# Altium project Charger.PrjPcb
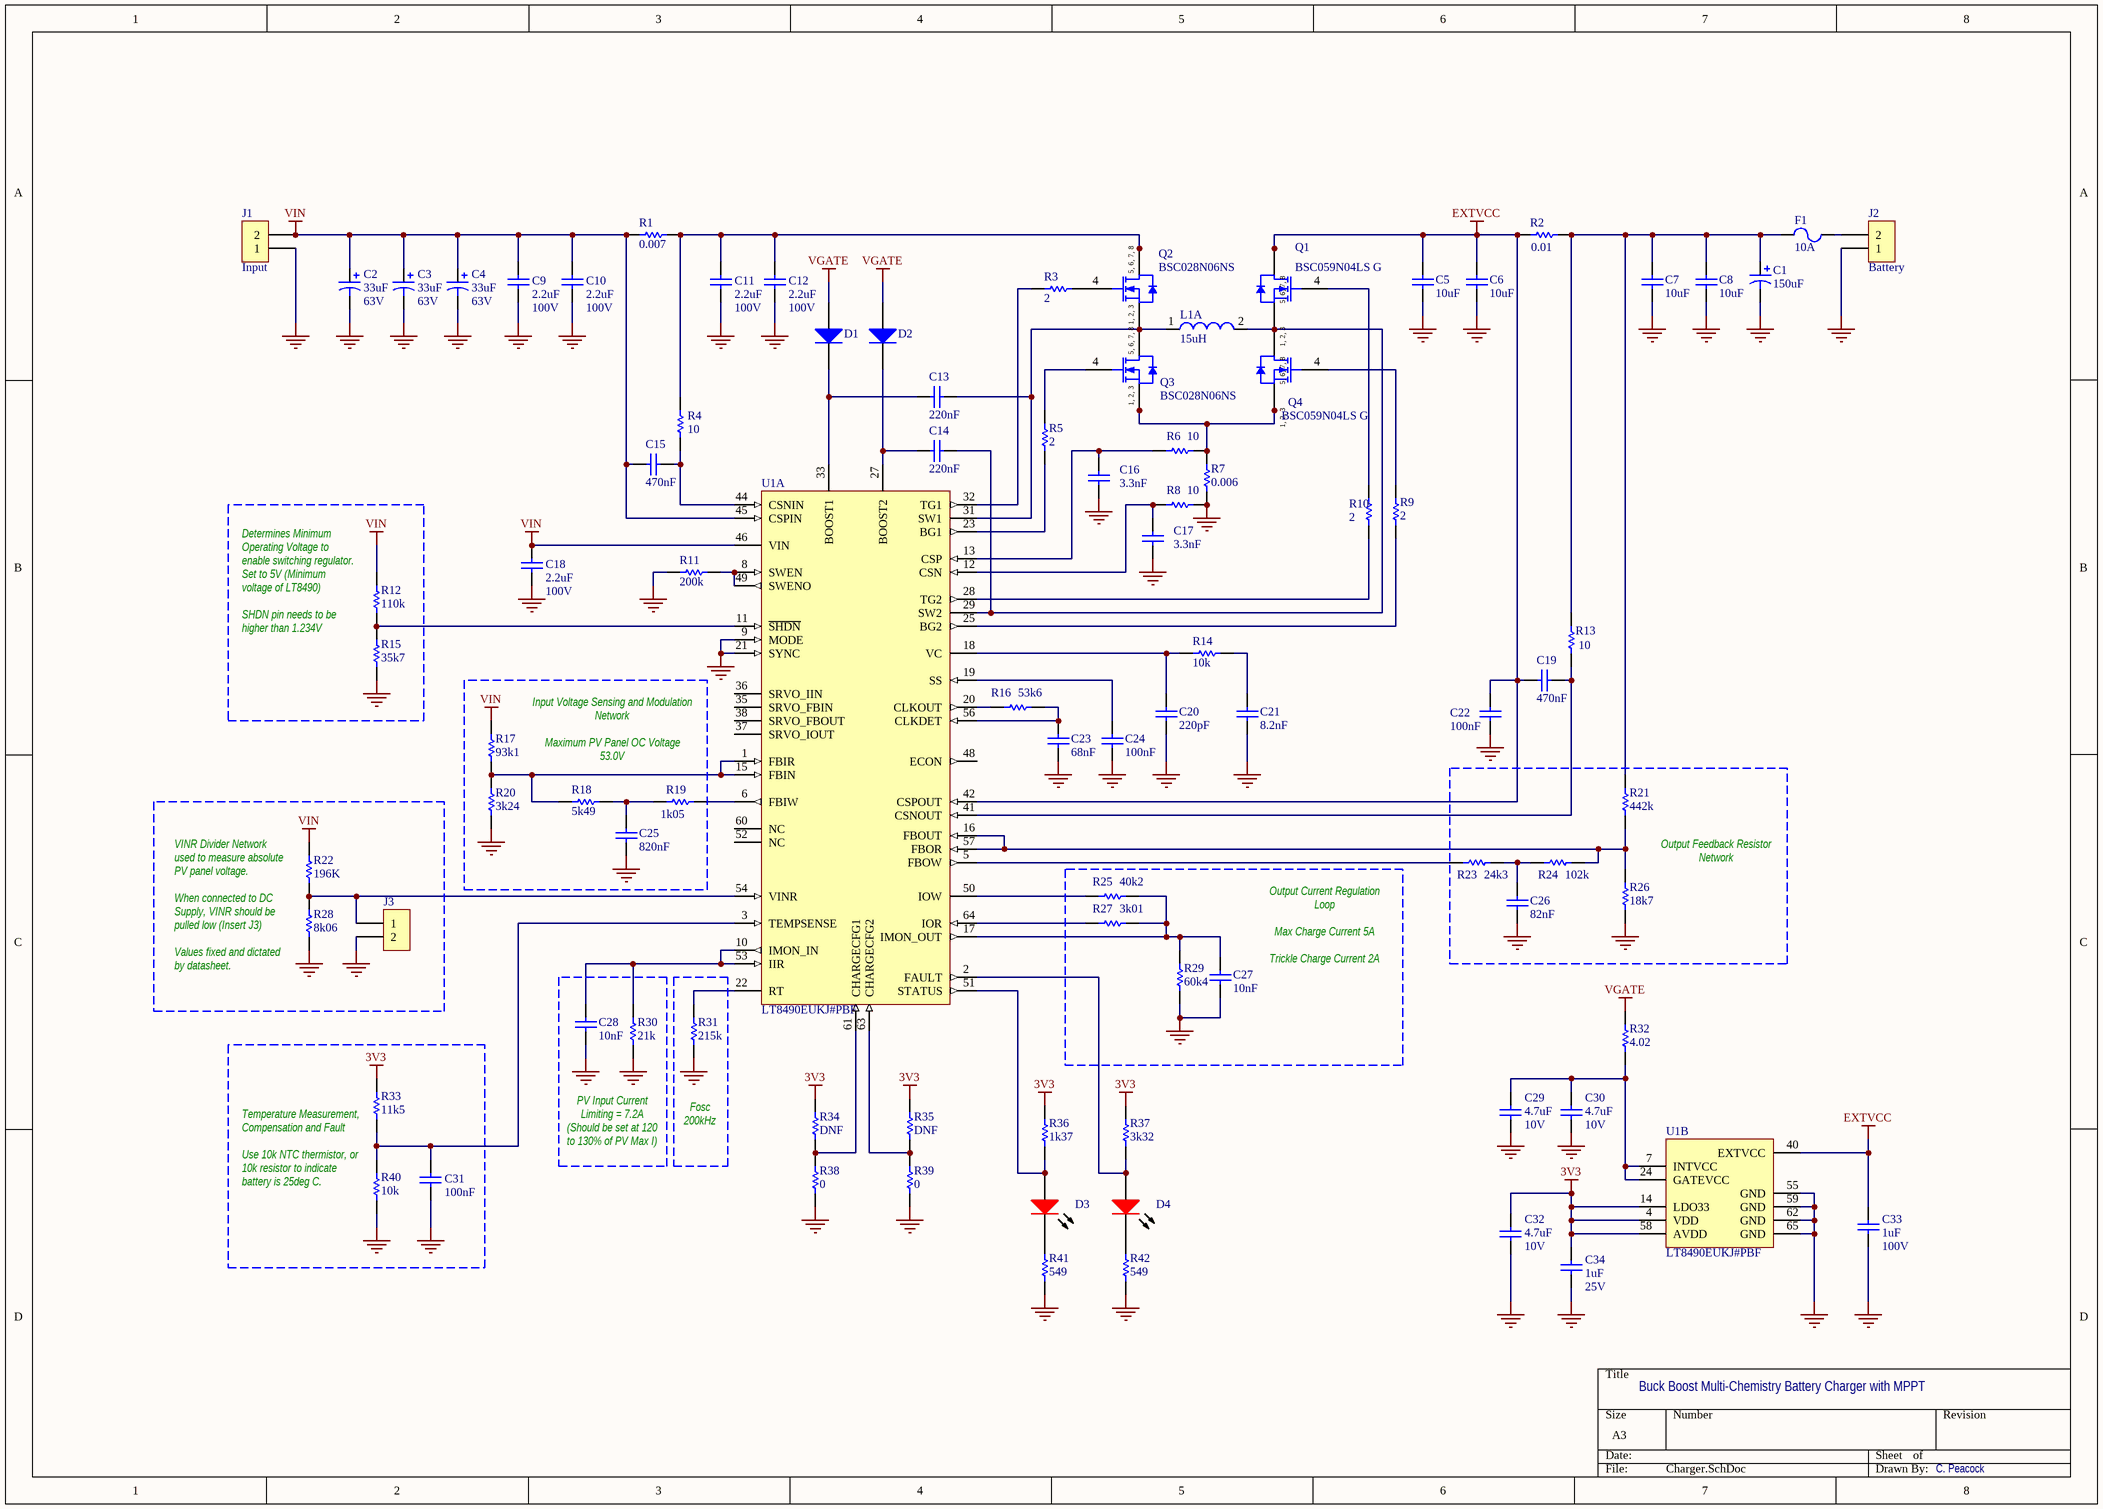
[diagram p0: Charger.SchDoc]
1 sheet, 90 parts. Net scope: global (net labels, ports and power ports of the same name join across sheets).
Board file: Charger.PcbDoc

## Sheet Charger.SchDoc
size A3; PageSetup: Record=PageOptions|CenterHorizontal=True|CenterVertical=True|PrintScale=0.73|XCorrection=1.00|YCorrection=1.00|PrintKind=0|BorderSize=5000000|LeftOffset=0|BottomOffset=0|Orientation=2|PaperLength=1000|PaperWidth=1000|Scale=100|PaperSource=7|PrintQuality=-3|MediaType=1|DitherType=10|PrintScaleMode=1|PaperKind=A4|PaperIndex=9

### Parts
C1  150uF  [PCB-h7n8m0mive84y4pjomrj-1]
C2  33uF  Voltage Rating (DC): 63V  [PCB-9g04u1co75526zy4kkrl-1]
C3  33uF  Voltage Rating (DC): 63V  [PCB-9g04u1co75526zy4kkrl-1]
C4  33uF  Voltage Rating (DC): 63V  [PCB-9g04u1co75526zy4kkrl-1]
C5  10uF  [PCB-41pvis4jpu9wge287x0a-1]
C6  10uF  [PCB-41pvis4jpu9wge287x0a-1]
C7  10uF  [PCB-41pvis4jpu9wge287x0a-1]
C8  10uF  [PCB-41pvis4jpu9wge287x0a-1]
C9  2.2uF  Voltage Rating (DC): 100V  [CAPC3225X279X50NL20T25]
C10  2.2uF  Voltage Rating (DC): 100V  [CAPC3225X279X50NL20T25]
C11  2.2uF  Voltage Rating (DC): 100V  [CAPC3225X279X50NL20T25]
C12  2.2uF  Voltage Rating (DC): 100V  [CAPC3225X279X50NL20T25]
C13  220nF  [CAPC2013X140X50ML20T25]
C14  220nF  [CAPC2013X140X50ML20T25]
C15  470nF  [CAPC2013X140X50ML20T25]
C16  3.3nF  [CAPC2013X94X50ML20T25]
C17  3.3nF  [CAPC2013X94X50ML20T25]
C18  2.2uF  Voltage Rating (DC): 100V  [CAPC3225X279X50NL20T25]
C19  470nF  [CAPC2013X140X50ML20T25]
C20  220pF  [CAPC2013X94X50ML20T25]
C21  8.2nF  [CAPC2013X94X50ML20T25]
C22  100nF  [CAPC2013X140X50ML20T25]
C23  68nF  [CAPC2013X94X50ML20T25]
C24  100nF  [CAPC2013X140X50ML20T25]
C25  820nF  [CAPC2013X95X45NL10T25]
C26  82nF  [CAPC2013X94X50ML20T25]
C27  10nF  [CAPC2013X94X50ML20T25]
C28  10nF  [CAPC2013X94X50ML20T25]
C29  4.7uF  Voltage Rating (DC): 10V  [CAPC2013X140X50ML20T25]
C30  4.7uF  Voltage Rating (DC): 10V  [CAPC2013X140X50ML20T25]
C31  100nF  [CAPC2013X140X50ML20T25]
C32  4.7uF  Voltage Rating (DC): 10V  [CAPC2013X140X50ML20T25]
C33  1uF  Voltage Rating (DC): 100V  [CAPC3225X279X50ML20T25]
C34  1uF  Voltage Rating (DC): 25V  [CAPC2013X140X50ML20T25]
D1  1N4148WS  [FSC-1N4148WS-SOD-323-2]  (value not drawn)
D2  1N4148WS  [FSC-1N4148WS-SOD-323-2]  (value not drawn)
D3  Lite-On LTST-C170KRKT  [PCB-5ta9mte2am12bu12jwvi-1]  (value not drawn)
D4  Lite-On LTST-C170KRKT  [PCB-5ta9mte2am12bu12jwvi-1]  (value not drawn)
F1  10A  [PCB-nlucop3bvobg45y57dd7-1]
J1  Input  [PCB-aknpg75yzj2hq04tmkjt-1]
J2  Battery  [PCB-aknpg75yzj2hq04tmkjt-1]
J3  Molex 90120-0762  [PCB-zbro1p3mqdrs1lkjydms-1]  (value not drawn)
L1  15uH  [WE-HCF 2818]  (part A of 2)
Q1  BSC059N04LS G  [INF-PG-TDSON-8-1_V]
Q2  BSC028N06NS  [INF-PG-TDSON-8-1_V]
Q3  BSC028N06NS  [INF-PG-TDSON-8-1_V]
Q4  BSC059N04LS G  [INF-PG-TDSON-8-1_V]
R1  0.007  [Resistor]
R2  0.01  [Resistor]
R3  2  [RESC2013X60X35NL10T20]
R4  10  [RESC2013X60X35ML10T20]
R5  2  [RESC2013X60X35ML10T20]
R6  10  [RESC2013X60X35ML10T20]
R7  0.006  [Resistor]
R8  10  [RESC2013X60X35ML10T20]
R9  2  [RESC2013X60X35ML10T20]
R10  2  [RESC2013X60X35ML10T20]
R11  200k  [RESC2013X60X35ML10T20]
R12  110k  [RESC2013X60X35ML10T20]
R13  10  [RESC2013X60X35ML10T20]
R14  10k  [RESC2013X60X35ML10T20]
R15  35k7  [RESC2013X60X35ML10T20]
R16  53k6  [RESC2013X60X35ML10T20]
R17  93k1  [RESC2013X60X35ML10T20]
R18  5k49  [RESC2013X60X35ML10T20]
R19  1k05  [RESC2013X60X35ML10T20]
R20  3k24  [RESC2013X60X35ML10T20]
R21  442k  [RESC2013X60X35ML10T20]
R22  196K  [RESC2013X60X35ML10T20]
R23  24k3  [RESC2013X60X35ML10T20]
R24  102k  [RESC2013X60X35ML10T20]
R25  40k2  [RESC2013X60X35ML10T20]
R26  18k7  [RESC2013X60X35ML10T20]
R27  3k01  [RESC2013X60X35ML10T20]
R28  8k06  [RESC2013X60X35ML10T20]
R29  60k4  [RESC2013X60X35ML10T20]
R30  21k  [RESC2013X60X35ML10T20]
R31  215k  [RESC2013X60X35ML10T20]
R32  4.02  [RESC2013X60X35ML10T20]
R33  11k5  [RESC2013X60X35ML10T20]
R34  DNF  [RESC2013X60X35ML10T20]
R35  DNF  [RESC2013X60X35ML10T20]
R36  1k37  [RESC2013X60X35ML10T20]
R37  3k32  [RESC2013X60X35ML10T20]
R38  0  [RESC2013X60X35ML10T20]
R39  0  [RESC2013X60X35ML10T20]
R40  10k  [RESC2013X60X35ML10T20]
R41  549  [RESC2013X60X35ML10T20]
R42  549  [RESC2013X60X35ML10T20]
U1  LT8490EUKJ#PBF  [LT-UKJ64(58)_V]  (parts A,B of 2)

### Nets
3V3: C32.2 C34.2 R33.2 R34.2 R35.2 R36.2 R37.2 U1.4(VDD) U1.14(LDO33) U1.58(AVDD)
EXTVCC: C5.2 C6.2 C19.1 C22.2 C33.2 Q1.5(DRAIN) Q1.6(DRAIN) Q1.7(DRAIN) Q1.8(DRAIN) R2.1 U1.40(EXTVCC) U1.42(CSPOUT)
GND: C1.2 C2.2 C3.2 C4.2 C5.1 C6.1 C7.1 C8.1 C9.1 C10.1 C11.1 C12.1 C16.1 C17.1 C18.1 C20.1 C21.1 C22.1 C23.1 C24.1 C25.1 C26.1 C27.1 C28.1 C29.1 C30.1 C31.1 C32.1 C33.1 C34.1 J1.1 J2.1 J3.2 R7.1 R8.1 R11.1 R15.1 R20.1 R26.1 R28.1 R29.1 R30.1 R31.1 R38.1 R39.1 R40.1 R41.1 R42.1 U1.9(MODE) U1.21(SYNC) U1.55(GND) U1.59(GND) U1.62(GND) U1.65(GND)
VGATE: D1.2(A) D2.2(A) R32.2
VIN: C2.1 C3.1 C4.1 C9.2 C10.2 C15.1 C18.2 J1.2 R1.1 R12.2 R17.2 R22.2 U1.45(CSPIN) U1.46(VIN)
NetC1_1: C1.1 C7.2 C8.2 F1.1 R2.2 R13.2 R21.2
NetC11_2: C11.2 C12.2 Q2.5(DRAIN) Q2.6(DRAIN) Q2.7(DRAIN) Q2.8(DRAIN) R1.2 R4.2
NetC13_1: C13.1 D1.1(K) U1.33(BOOST1)
NetC13_2: C13.2 L1.1 Q2.1(SOURCE) Q2.2(SOURCE) Q2.3(SOURCE) Q3.5(DRAIN) Q3.6(DRAIN) Q3.7(DRAIN) Q3.8(DRAIN) U1.31(SW1)
NetC14_1: C14.1 D2.1(K) U1.27(BOOST2)
NetC14_2: C14.2 L1.2 Q1.1(SOURCE) Q1.2(SOURCE) Q1.3(SOURCE) Q4.5(DRAIN) Q4.6(DRAIN) Q4.7(DRAIN) Q4.8(DRAIN) U1.29(SW2)
NetC15_2: C15.2 R4.1 U1.44(CSNIN)
NetC16_2: C16.2 R6.2 U1.13(CSP)
NetC17_2: C17.2 R8.2 U1.12(CSN)
NetC19_2: C19.2 R13.1 U1.41(CSNOUT)
NetC20_2: C20.2 R14.2 U1.18(VC)
NetC21_2: C21.2 R14.1
NetC23_2: C23.2 R16.2 U1.56(CLKDET)
NetC24_2: C24.2 U1.19(SS)
NetC25_2: C25.2 R18.2 R19.1
NetC26_2: C26.2 R23.2 R24.1
NetC27_2: C27.2 R25.2 R27.2 R29.2 U1.17(IMON_OUT)
NetC28_2: C28.2 R30.2 U1.10(IMON_IN) U1.53(IIR)
NetC29_2: C29.2 C30.2 R32.1 U1.7(INTVCC) U1.24(GATEVCC)
NetC31_2: C31.2 R33.1 R40.2 U1.3(TEMPSENSE)
NetD3_1: D3.1(K) R41.2
NetD3_2: D3.2(A) R36.1 U1.51(STATUS)
NetD4_1: D4.1(K) R42.2
NetD4_2: D4.2(A) R37.1 U1.2(FAULT)
NetF1_2: F1.2 J2.2
NetJ3_1: J3.1 R22.1 R28.2 U1.54(VINR)
NetQ1_4: Q1.4(GATE) R10.2
NetQ2_4: Q2.4(GATE) R3.2
NetQ3_1: Q3.1(SOURCE) Q3.2(SOURCE) Q3.3(SOURCE) Q4.1(SOURCE) Q4.2(SOURCE) Q4.3(SOURCE) R6.1 R7.2
NetQ3_4: Q3.4(GATE) R5.2
NetQ4_4: Q4.4(GATE) R9.2
NetR3_1: R3.1 U1.32(TG1)
NetR5_1: R5.1 U1.23(BG1)
NetR9_1: R9.1 U1.25(BG2)
NetR10_1: R10.1 U1.28(TG2)
NetR11_2: R11.2 U1.8(SWEN) U1.49(SWENO)
NetR12_1: R12.1 R15.2 U1.11(~{SHDN})
NetR16_1: R16.1 U1.20(CLKOUT)
NetR17_1: R17.1 R18.1 R20.2 U1.1(FBIR) U1.15(FBIN)
NetR19_2: R19.2 U1.6(FBIW)
NetR21_1: R21.1 R24.2 R26.2 U1.16(FBOUT) U1.57(FBOR)
NetR23_1: R23.1 U1.5(FBOW)
NetR25_1: R25.1 U1.50(IOW)
NetR27_1: R27.1 U1.64(IOR)
NetR31_2: R31.2 U1.22(RT)
NetR34_1: R34.1 R38.2 U1.61(CHARGECFG1)
NetR35_1: R35.1 R39.2 U1.63(CHARGECFG2)

Not connected (* = marked no-connect by the designer): U1 35(SRVO_FBIN) 36(SRVO_IIN) 37(SRVO_IOUT) 38(SRVO_FBOUT) 48(ECON) 52(NC) 60(NC)

### Notes on the sheet
- Determines Minimum Operating Voltage to enable switching regulator. Set to 5V (Minimum voltage of LT8490)
  SHDN pin needs to be higher than 1.234V
- Input Voltage Sensing and Modulation Network
  Maximum PV Panel OC Voltage 53.0V
- Output Feedback Resistor Network
- VINR Divider Network used to measure absolute PV panel voltage.
  When connected to DC Supply, VINR should be pulled low (Insert J3)
  Values fixed and dictated by datasheet.
- (near C27) Output Current Regulation Loop
  Max Charge Current 5A
  Trickle Charge Current 2A
- PV Input Current Limiting = 7.2A (Should be set at 120 to 130% of PV Max I)
- Fosc 200kHz
- Temperature Measurement, Compensation and Fault
  Use 10k NTC thermistor, or 10k resistor to indicate battery is 25deg C.
- Buck Boost Multi-Chemistry Battery Charger with MPPT
- C. Peacock
- (in symbol CMP-840507-3) 5, 6, 7, 8; 1, 2, 3
- (in symbol CMP-4153327-3) 5, 6, 7, 8; 1, 2, 3

### Library data of the parts
C1 = CMP-38bcf3ec736fe77b-2: Capacitor Alum Elec, 150uf, 20%, 50v, Capacitor Alum Elec, 150uf, 20%, 50v, Smd, Full Reel
C2-C4 = CMP-7693bfcb6deba954-1: Cap Aluminum Lytic 33uF 63V 20% (8 X 10.2mm) SMD 250mA 2000h 105C Automotive T/R; Manufacturer Part Number: EEEFK1J330P; Lead-Free Status: Lead Free; Capacitance: 33.0 F; Dielectric Material: Aluminum Electrolytic; Packaging: Cut Tape (CT); REACH SVHC Compliance: No SVHC; OctopartID: 7693bfcb6deba954; Mounting Style: Surface Mount; Octopart URL: http://octopart.com/eeefk1j330p-panasonic-5389854; Capacitance Tolerance: ±20%; RoHS: Compliant; Size-Length: 10.2 mm; Lifecycle Status: Not Listed by Manufacturer; Number of Pins: 2; Size-Width: 10.0 mm; Size-Height: 10.2 mm; Size-Diameter: 8.00 mm
C5-C8 = CMP-bd5774f6f82f6290-1: 1210 10 uF 35 V ±10% Tolerance X7R SMT Multilayer Ceramic Capacitor; Manufacturer Part Number: GRM32ER7YA106KA12L; Case/Package (SI): 3225; Voltage Rating (DC): 35.0 V; Capacitance: 10.0 µF; Lead-Free Status: Lead Free; RoHS: Compliant; Case/Package: 1210; Dielectric Characteristic: X7R; Mounting Style: Surface Mount; REACH SVHC Compliance: No SVHC; OctopartID: bd5774f6f82f6290; Lifecycle Status: Active; Size-Width: 2.50 mm; Size-Length: 3.20 mm; Number of Pins: 2; Packaging: Cut Tape (CT); Octopart URL: http://octopart.com/grm32er7ya106ka12l-murata-11231262; Capacitance Tolerance: ±10%; Size-Thickness: 2.50 mm
C9-C12 C18 = CMP-2511202-3: Cap Ceramic 2.2uF 100V X7R 10% SMD 1210 125C Embossed T/R; Manufacturer Part Number: 12101C225KAT2A; Lead-Free Status: Lead Free; Capacitance: 2.2e-06 F; Dielectric Material: Ceramic Multilayer; RoHS: Compliant; Dielectric Characteristic: X7R; REACH SVHC Compliance: No SVHC; Octopart Url: https://octopart.com/12101c225kat2a-avx+interconnect+%2F+elco-8397867; Case/Package: 1210; Mounting Style: Surface Mount; Number of Pins: 2; OctopartID: bae87362bba5652f; Capacitance Tolerance: ±10%
C13 C14 = CMP-3551434-3: Multilayer Ceramic Capacitors MLCC - SMD/SMT 50volts .22uF 5% X7R 7inch reel; Manufacturer Part Number: 08055C224JAT2A; Voltage Rating (DC): 50.0 V; Lead-Free Status: Lead Free; Capacitance: 2.2e-07 F; Octopart Url: https://octopart.com/08055c224jat2a-avx+interconnect+%2F+elco-8665279; Mounting Style: Surface Mount; Capacitance Tolerance: ±5%; Dielectric Characteristic: X7R; Case/Package: 0805; Number of Pins: 2; RoHS: Compliant; OctopartID: 61bba8357c62be7c
C15 C19 = CMP-3555014-4: Multilayer Ceramic Capacitors MLCC - SMD/SMT .47uF 50v 20% Tol.; Manufacturer Part Number: 08055C474JAT2A; Dielectric Characteristic: X7R; Voltage Rating (DC): 50.0 V; Lead-Free Status: Lead Free; Capacitance: 4.7e-07 F; Capacitance Tolerance: ±5%; Mounting Style: Surface Mount; OctopartID: 179bde150a1fc85c; Number of Pins: 2; Octopart Url: https://octopart.com/08055c474jat2a-avx+interconnect+%2F+elco-8665314; RoHS: Compliant; Case/Package: 0805
C16 C17 = CMP-173641-3: CAP CER 3300PF 50V 5% X7R 0805; Manufacturer Part Number: 08055C332JAT2A; Voltage Rating (DC): 50.0 V; Lead-Free Status: Lead Free; Case/Package (SI): 2012; Capacitance: 3.3e-09 F; Packaging: Tape; Octopart Url: https://octopart.com/08055c332jat2a-avx+interconnect+%2F+elco-2337728; Number of Pins: 2; OctopartID: c7870eae49211840; Dielectric Characteristic: X7R; Capacitance Tolerance: ±5%; Case/Package: 0805; RoHS: Compliant; Mounting Style: Surface Mount
C20 = CMP-173636-3: CAP CER 220PF 50V 5% X7R 0805; Manufacturer Part Number: 08055C221JAT2A; Lead-Free Status: Lead Free; Capacitance: 2.2e-10 F; Voltage Rating (DC): 50.0 V; Case/Package (SI): 2012; Capacitance Tolerance: ±5%; Number of Pins: 2; Case/Package: 0805; Mounting Style: Surface Mount; Dielectric Characteristic: X7R; RoHS: Compliant; OctopartID: e36a2ae4feb53cad; Packaging: Tape; Octopart Url: https://octopart.com/08055c221jat2a-avx+interconnect+%2F+elco-8665273
C21 = CMP-173647-3: CAP CER 8200PF 50V 5% X7R 0805; Manufacturer Part Number: 08055C822JAT2A; Voltage Rating (DC): 50.0 V; Capacitance: 8.2e-09 F; Case/Package (SI): 2012; Lead-Free Status: Lead Free; Packaging: Tape & Reel (TR); Octopart Url: https://octopart.com/08055c822jat2a-avx+interconnect+%2F+elco-8665338; OctopartID: f3cd3a43ee512c0a; Dielectric Characteristic: X7R; Case/Package: 0805; Mounting Style: Surface Mount; Number of Pins: 2; RoHS: Compliant; Capacitance Tolerance: ±5%
C22 C24 C31 = CMP-54a29ee556ae8b65-2: Capacitor; Ceramic; Cap 0.1 uF; Tol 5%; Vol-Rtg 50 VDC; SMT; 0805; X7R; Tape & Reel; Manufacturer Part Number: 08055C104JAT2A; Insulation Resistance: 100 GΩ; Lead-Free Status: Lead Free; Case/Package (SI): 2012; Voltage Rating (DC): 50.0 V; Size-Height: 710 µm; Capacitance: 100 nF; Case/Package: 0805; Octopart URL: http://octopart.com/08055c104jat2a-avx-55388010; RoHS: Compliant; OctopartID: 54a29ee556ae8b65; Mounting Style: Surface Mount; Capacitance Tolerance: ±5%; Size-Length: 2.01 mm; Dielectric Characteristic: X7R; Size-Thickness: 940 µm; Packaging: Tape & Reel (TR), Cut Tape (CT); Number of Pins: 2; REACH SVHC Compliance: No SVHC; Size-Width: 1.24 mm
C23 = CMP-174430-3: CAP CER 0.068UF 50V 5% X7R 0805; Manufacturer Part Number: 08055C683JAT2A; Capacitance: 6.8e-08 F; Case/Package (SI): 2012; Voltage Rating (DC): 50.0 V; Capacitance Tolerance: ±5%; Case/Package: 0805; Dielectric Characteristic: X7R; Mounting Style: Surface Mount; Number of Pins: 2; Octopart Url: https://octopart.com/08055c683jat2a-avx+interconnect+%2F+elco-2337734; OctopartID: 5c189531d2b883df; Packaging: Tape; RoHS: Compliant
C25 = CMP-139721-3: Multilayer Ceramic Capacitors MLCC - SMD/SMT 0.82uF 25Volts X7R 0.1; Manufacturer Part Number: GRM219R71E824KA88D; Capacitance Tolerance: ±10%; Case/Package (SI): 2012; Capacitance: 8.2e-07 F; Voltage Rating (DC): 25.0 V; Dielectric Characteristic: X7R; Case/Package: 0805; RoHS: Compliant; Size-Width: 0.00125 m; Size-Thickness: 0.00085 m; Octopart Url: https://octopart.com/grm219r71e824ka88d-murata-17960236; Lifecycle Status: Active; OctopartID: 70d4b8cc589eaf13; Size-Length: 0.002 m
C26 = CMP-174432-3: CAP CER 0.082UF 50V 5% X7R 0805; Manufacturer Part Number: 08055C823JAT2A; Capacitance: 8.2e-08 F; Case/Package (SI): 2012; Lead-Free Status: Lead Free; Voltage Rating (DC): 50.0 V; Capacitance Tolerance: ±5%; Case/Package: 0805; Dielectric Characteristic: X7R; Mounting Style: Surface Mount; Number of Pins: 2; Octopart Url: https://octopart.com/08055c823jat2a-avx+interconnect+%2F+elco-3894214; OctopartID: 61d7a8e62f77be10; Packaging: Tape; RoHS: Compliant
C27 = CMP-16466678-4: cap smd 0805; Manufacturer Part Number: 08055C103JAT2A; Capacitance Tolerance: ±5%; Case/Package (SI): 2012; Capacitance: 1e-08 F; Voltage Rating (DC): 50.0 V; Dielectric Characteristic: X7R; Dielectric Material: Ceramic Multilayer; Lead-Free Status: Lead Free; Insulation Resistance: 1e+11 Ω; Size-Width: 0.0012446 m; REACH SVHC Compliance: No SVHC; Case/Package: 0805; Mounting Style: Surface Mount; Size-Thickness: 0.0009398 m; Octopart Url: https://octopart.com/08055c103jat2a-avx+interconnect+%2F+elco-39513106; Size-Height: 0.00094 m; Size-Length: 0.0020066 m; Number of Pins: 2; RoHS: Compliant; OctopartID: 02fac9aacb8edd3d
C28 = CMP-16466678-5: CAP CER 10NF 50V 5% X7R 0805; Manufacturer Part Number: 08055C103JAT2A; Capacitance: 1e-08 F; Insulation Resistance: 1e+11 Ω; Voltage Rating (DC): 50.0 V; Dielectric Material: Ceramic Multilayer; Lead-Free Status: Lead Free; Case/Package (SI): 2012; Octopart Url: https://octopart.com/08055c103jat2a-avx+interconnect+%2F+elco-39513106; Capacitance Tolerance: ±5%; OctopartID: 02fac9aacb8edd3d; Number of Pins: 2; Size-Height: 0.00094 m; Size-Width: 0.0012446 m; RoHS: Compliant; REACH SVHC Compliance: No SVHC; Size-Length: 0.0020066 m; Size-Thickness: 0.0009398 m; Case/Package: 0805; Dielectric Characteristic: X7R; Mounting Style: Surface Mount
C29 C30 C32 = CMP-126761-3: CAP CER 4.7UF 10V 10% X5R 0805; Manufacturer Part Number: 0805ZD475KAT2A; Dielectric Material: Ceramic Multilayer; Case/Package (SI): 2012; Capacitance: 4.7e-06 F; Lead-Free Status: Lead Free; Number of Pins: 2; OctopartID: 520399539b708dc4; Mounting Style: Surface Mount; Size-Height: 0.0014 m; Octopart Url: https://octopart.com/0805zd475kat2a-avx+interconnect+%2F+elco-39513109; Case/Package: 0805; Capacitance Tolerance: ±10%; Dielectric Characteristic: X5R; Size-Length: 0.00201 m; REACH SVHC Compliance: No SVHC; RoHS: Compliant; Size-Width: 0.00125 m
C33 = CMP-127163-3: CAP CER 1UF 100V 10% X7R 1210; Manufacturer Part Number: 12101C105KAT2A; Capacitance: 1e-06 F; Dielectric Material: Ceramic Multilayer; Lead-Free Status: Lead Free; Capacitance Tolerance: ±10%; Case/Package: 1210; Dielectric Characteristic: X7R; Mounting Style: Surface Mount; Number of Pins: 2; Octopart Url: https://octopart.com/12101c105kat2a-avx+interconnect+%2F+elco-39513114; OctopartID: 9d625632541e42a5; REACH SVHC Compliance: No SVHC; RoHS: Compliant; Size-Height: 0.00279 m; Size-Length: 0.0032 m; Size-Width: 0.0025 m
C34 = CMP-126978-4: CAP CER 1UF 25V 10% X5R 0805; Manufacturer Part Number: 08053D105KAT2A; Dielectric Material: Ceramic Multilayer; Capacitance: 1e-06 F; Case/Package (SI): 2012; Lead-Free Status: Lead Free; Capacitance Tolerance: ±10%; Octopart Url: https://octopart.com/08053d105kat2a-avx+interconnect+%2F+elco-39962614; REACH SVHC Compliance: No SVHC; Size-Width: 0.00125 m; OctopartID: 11eada81f37ace2d; Mounting Style: Surface Mount; Dielectric Characteristic: X5R; Size-Height: 0.0014 m; Number of Pins: 2; Case/Package: 0805; RoHS: Compliant; Size-Length: 0.00201 m
D1 D2 = CMP-814637-6: DIODE GEN PURP 75V 150MA SOD323F; Lead-Free Status: Lead Free; Mounting Style: Surface Mount; Manufacturer Part Number: 1N4148WS; Number of Pins: 2; REACH SVHC Compliance: No SVHC; Octopart Url: https://octopart.com/1n4148ws-fairchild+semiconductor-7851016; OctopartID: 57779e0abe1988b0; RoHS: Compliant; Lifecycle Status: Active
D3 D4 = CMP-1544870-4: Red 2 x 1.25 x 1.1 mm 130° Water Clear 54 mcd 2 V LED Surface Mount; Wavelength: 639 nm; Lens Type: Non-Diffused; Lead-Free Status: Lead Free; Case/Package (SI): 2012; Luminous Intensity: 54.0 mcd; Forward Voltage: 2.00 V; Size-Length: 2.00 mm; Octopart URL: http://octopart.com/ltst-c170krkt-lite-on-549878; Size-Height: 1.10 mm; Size-Width: 1.25 mm; Manufacturer Part Number: LTST-C170KRKT; Viewing Angle: 130 °; Packaging: Cut Tape (CT), Tape & Reel (TR); OctopartID: 1d24d4265bb4c2e3; Color: Red; Case/Package: 0805; Mounting Style: Surface Mount, Vertical; RoHS: Compliant
F1 = CMP-254385-4: 154 Series Fast-Acting 125 V 10 A OMNI-BLOK® Surface Mount Fuse & Holder; Manufacturer Part Number: 0154010.DR; Voltage Rating (AC): 125 V; Lead-Free Status: Lead Free; Color: White; Current Rating: 10.0 A; REACH SVHC Compliance: No SVHC; RoHS: Compliant; Mounting Style: Surface Mount, PCB; Packaging: Cut Tape (CT); Size-Width: 5.03 mm; Flammability Rating: UL 94 V-0; Octopart URL: http://octopart.com/0154010.dr-littelfuse-565890; Voltage Rating (DC): 125 V; OctopartID: 0e9fc79d897bd158; Size-Length: 9.73 mm; Size-Height: 3.81 mm
J1 J2 = CMP-0680cf8a1162d947-2: Phoenix 1757242 MSTBA 2.5/ 2-G-5.08 Base Strip/Header 4 Kilo-Volt Surge 320 Volt Rated III/2 12 Amp Green Plug-In; Voltage Rating (DC): 320.0 V; Lead-Free Status: Lead Free; Gender: Male; Number of Contacts: 2; Current Rating: 12.0 A; Mounting Angle: 90.0 °; Pin Pitch: 0.00508 m; Size-Length: 0.01216 m; OctopartID: 0680cf8a1162d947; Housing Color: Green; Size-Width: 0.00508 m; Mounting Style: PCB, Through Hole, Solder; Manufacturer Part Number: 1757242; RoHS: Compliant; Flammability Rating: UL 94 V-0; REACH SVHC Compliance: No SVHC; Color: Green; Octopart URL: http://octopart.com/1757242-phoenix+contact-12932; Number of Rows: 1; Number of Positions: 2; Housing Material: Plastic; Size-Height: 0.0086 m
J3 = CMP-8fae46aeaafe5069-4: 2.54mm (.100") Pitch C-Grid III Header, Single Row, Vertical, 1 Circuits, Gold (Au) Plating; Glow Wire Compliant: Non-Compliant; Number of Contacts: 2; Insulation Resistance: 5000000000.0 Ω; Pin Pitch: 0.00254 m; Voltage Rating (AC): 350.0 V; Number of Circuits: 1; Lead-Free Status: Lead Free; Current Rating: 3.0 A; Gender: Male; Contact Resistance: 0.02 Ω; Manufacturer Part Number: 90120-0762; Orientation: Vertical; Housing Color: Black; Octopart URL: http://octopart.com/90120-0762-molex-655414; Size-Width: 0.00254 m; Number of Positions: 2; Packaging: Bag; Housing Material: Plastic; OctopartID: 8fae46aeaafe5069; Halogen Free Status: Not Reviewed; Number of Rows: 1; Voltage Rating (DC): 350.0 V; Size-Height: 0.0025 m; Contact Plating: Gold; Contact Material: Brass; Size-Length: 0.00508 m; Lifecycle Status: Not Listed by Manufacturer; Mounting Style: Through Hole, Vertical; RoHS: Compliant
L1 = CMP-19365683-2: SMD High Current Inductor WE-HCF, L=15µH; Inductance: 1.5e-05 H; Octopart Url: https://octopart.com/7443641500-w%C3%BCrth+elektronik-46948338; OctopartID: 6df2a6341766b235; Packaging: Cut Tape (CT); REACH SVHC Compliance: No SVHC; RoHS: Compliant
Q1 Q4 = CMP-840507-3: N-Channel OptiMOS 3 Power-Transistor, 40 V VDS, 73 A ID, -55 to 150 degC, PG-TDSON-8-1, Reel, Green; Power Dissipation: 50.0 W; OctopartID: 4ade8314a8689519; REACH SVHC Compliance: No SVHC; Manufacturer Part Number: BSC059N04LS G; Polarity: N-Channel; Octopart Url: https://octopart.com/bsc059n04ls+g-infineon-12634064; Number of Pins: 8; RoHS: Compliant
Q2 Q3 = CMP-4153327-3: N-Channel OptiMOS Power-Transistor, 60 V VDS, 100 A ID, -55 to 150 degC, PG-TDSON-8-1, Reel, Green; Lead-Free Status: Lead Free; Manufacturer Part Number: BSC028N06NS; RoHS: Compliant; Number of Pins: 8; OctopartID: 69bea1df4ef0b679; Polarity: N-Channel; Octopart Url: https://octopart.com/bsc028n06ns-infineon-23790120; REACH SVHC Compliance: No SVHC
R1 = CMP-3140fbc44d5aee87-2: Res Metal Alloy 2512 7m Ohm 1% 2W ±75ppm/°C Molded SMD Embossed Carrier T/R; Manufacturer Part Number: ERJ-MS4HF7M0U; Power Rating: 2.00W; Resistance: 7.0 mΩ; Packaging: Cut Tape (CT); Octopart URL: https://octopart.com/erj-ms4hf7m0u-panasonic-59660668; Lifecycle Status: Not Listed by Manufacturer; Resistance Tolerance: ±1%; RoHS: Compliant
R2 = CMP-3ffef57a43e1e039-1: Res Metal Alloy 2512 10m Ohm 1% 2W ±75ppm/°C Molded SMD Embossed Carrier T/R; Manufacturer Part Number: ERJ-MS4HF10MU; Power Rating: 2.00 W; Resistance: 10.0 m?; Octopart URL: http://octopart.com/erj-ms4hf10mu-panasonic-59660665; RoHS: Compliant; Resistance Tolerance: ±1%; Packaging: Cut Tape (CT); Lifecycle Status: Not Listed by Manufacturer; OctopartID: 3ffef57a43e1e039
R3 R5 R9 R10 = CMP-0849c1512bc3d78e-1: RC Series 0805 0.125 W 2 Ohms 1% ±100 ppm/°C SMT Thick Film Chip Resistor; Manufacturer Part Number: RC0805FR-072RL; Power Rating: 125 mW; Lead-Free Status: Lead Free; Case/Package (SI): 2012; Voltage Rating (DC): 150 V; Resistance: 2.00 Ω; Size-Height: 500 µm; Size-Width: 1.25 mm; Size-Length: 2.00 mm; Mounting Style: Surface Mount; Octopart URL: http://octopart.com/rc0805fr-072rl-yageo-1181420; RoHS: Compliant; Case/Package: 0805; Resistance Tolerance: ±1%; OctopartID: 0849c1512bc3d78e
R4 R6 R8 R13 = CMP-0281c9fbc26fdd46-3: RC Series 0805 0.125 W 10 Ohms 1% ±100 ppm/°C SMT Thick Film Chip Resistor; Manufacturer Part Number: RC0805FR-0710RL; Voltage Rating (DC): 150 V; Power Rating: 125 mW; Case/Package (SI): 2012; Lead-Free Status: Lead Free; Resistance: 10.0 Ω; Size-Length: 2.00 mm; Size-Height: 500 µm; REACH SVHC Compliance: No SVHC; Number of Pins: 2; Packaging: Cut Tape (CT), Tape & Reel (TR); Mounting Style: Surface Mount; OctopartID: 0281c9fbc26fdd46; RoHS: Compliant; Octopart URL: http://octopart.com/rc0805fr-0710rl-yageo-40953224; Case/Package: 0805; Size-Width: 1.25 mm; Resistance Tolerance: ±1%
R7 = CMP-23c4e9405fd9fc03-1: Res Metal Alloy 2512 6m Ohm 1% 3W ±75ppm/°C Molded SMD Embossed Carrier T/R; Manufacturer Part Number: ERJ-MS4HF6M0U; Resistance: 6.00 mΩ; Octopart URL: http://octopart.com/erj-ms4hf6m0u-panasonic-59660667; Lifecycle Status: Not Listed by Manufacturer; RoHS: Compliant; Packaging: Cut Tape (CT); Resistance Tolerance: ±1%; OctopartID: 23c4e9405fd9fc03
R11 = CMP-e4272f597d573be0-1: RC Series 0805 0.125 W 200 kOhms 1% ±100 ppm/°C SMT Thick Film Chip Resistor; Manufacturer Part Number: RC0805FR-07200KL; Voltage Rating (DC): 150 V; Lead-Free Status: Lead Free; Resistance: 200 kΩ; Case/Package (SI): 2012; Power Rating: 125 mW; Size-Width: 1.25 mm; Case/Package: 0805; Size-Length: 2.00 mm; Packaging: Tape & Reel (TR), Cut Tape (CT); Resistance Tolerance: ±1%; OctopartID: e4272f597d573be0; Number of Pins: 2; Octopart URL: http://octopart.com/rc0805fr-07200kl-yageo-41204758; RoHS: Compliant; Mounting Style: Surface Mount; Size-Height: 500 µm
R12 = CMP-38f6f2b2e11ce731-2: RC Series 0805 0.125 W 110 kOhms 1% ±100 ppm/°C SMT Thick Film Chip Resistor; Manufacturer Part Number: RC0805FR-07110KL; Power Rating: 125 mW; Lead-Free Status: Lead Free; Resistance: 110 kΩ; Voltage Rating (DC): 150 V; Case/Package (SI): 2012; OctopartID: 38f6f2b2e11ce731; Size-Width: 1.25 mm; Size-Height: 500 µm; Size-Length: 2.00 mm; Mounting Style: Surface Mount; Case/Package: 0805; Resistance Tolerance: ±1%; RoHS: Compliant; Octopart URL: http://octopart.com/rc0805fr-07110kl-yageo-55508108
R14 R40 = CMP-1854303-12: RC Series 0805 0.125 W 10 kOhms 1% ±100 ppm/°C SMT Thick Film Chip Resistor; Manufacturer Part Number: RC0805FR-0710KL; Case/Package (SI): 2012; Voltage Rating (DC): 150.0 V; Resistance: 10000.0 Ω; Lead-Free Status: Lead Free; Power Rating: 0.125 W; Size-Width: 0.00125 m; Size-Length: 0.002 m; OctopartID: d971121d0e3806b6; Case/Package: 0805; Mounting Style: Surface Mount; REACH SVHC Compliance: No SVHC; Resistance Tolerance: ±1%; Number of Pins: 2; Octopart Url: http://octopart.com/rc0805fr-0710kl-yageo-40301103; Size-Height: 0.0005 m; Seller Landing  Url: https://octopart-clicks.com/click/track?country=US&ak=8157f166&sig=02da2a9&sid=5489&ppid=40301103&vpid=114937402&ct=offers; RoHS: Compliant
R15 = CMP-1866102-3: RC Series 0805 0.125 W 35.7 kOhms 1% ±100 ppm/°C SMT Thick Film Chip Resistor; Manufacturer Part Number: RC0805FR-0735K7L; Voltage Rating (DC): 150.0 V; Power Rating: 0.125 W; Resistance: 35700.0 Ω; Lead-Free Status: Lead Free; Case/Package (SI): 2012; Size-Width: 0.00125 m; Case/Package: 0805; OctopartID: b5947c8f4a1e6a53; Size-Length: 0.002 m; Resistance Tolerance: ±1%; RoHS: Compliant; Size-Height: 0.0005 m; Mounting Style: Surface Mount; Octopart Url: https://octopart.com/rc0805fr-0735k7l-yageo-1170156
R16 = CMP-1854567-3: RC Series 0805 0.125 W 53.6 kOhms 1% ±100 ppm/°C SMT Thick Film Chip Resistor; Manufacturer Part Number: RC0805FR-0753K6L; Case/Package (SI): 2012; Power Rating: 0.125 W; Voltage Rating (DC): 150.0 V; Lead-Free Status: Lead Free; Resistance: 53600.0 Ω; Resistance Tolerance: ±1%; Size-Width: 0.00125 m; Octopart Url: https://octopart.com/rc0805fr-0753k6l-yageo-1205943; Size-Height: 0.0005 m; OctopartID: e4342d2ca7e53bf3; RoHS: Compliant; Case/Package: 0805; Size-Length: 0.002 m; Mounting Style: Surface Mount
R17 = CMP-1854487-3: RC Series 0805 0.125 W 93.1 kOhms 1% ±100 ppm/°C SMT Thick Film Chip Resistor; Manufacturer Part Number: RC0805FR-0793K1L; Resistance: 93100.0 Ω; Case/Package (SI): 2012; Lead-Free Status: Lead Free; Power Rating: 0.125 W; Voltage Rating (DC): 150.0 V; RoHS: Compliant; Resistance Tolerance: ±1%; Mounting Style: Surface Mount; Octopart Url: https://octopart.com/rc0805fr-0793k1l-yageo-1183647; Size-Length: 0.002 m; OctopartID: 2b37e22f01cef4f0; Size-Height: 0.0005 m; Case/Package: 0805; Size-Width: 0.00125 m
R18 = CMP-1875616-3: RC Series 0805 0.125 W 5.49 kOhms 1% ±100 ppm/°C SMT Thick Film Chip Resistor; Manufacturer Part Number: RC0805FR-075K49L; Lead-Free Status: Lead Free; Voltage Rating (DC): 150.0 V; Resistance: 5490.0 Ω; Case/Package (SI): 2012; Power Rating: 0.125 W; Size-Height: 0.0005 m; Size-Width: 0.00125 m; Octopart Url: https://octopart.com/rc0805fr-075k49l-yageo-1228112; RoHS: Compliant; Resistance Tolerance: ±1%; Size-Length: 0.002 m; Mounting Style: Surface Mount; OctopartID: 5ec597ddc6f38102; Case/Package: 0805
R19 = CMP-b5997e3e74036a5e-1: RC Series 0805 0.125 W 1.05 kOhms 1% ±100 ppm/°C SMT Thick Film Chip Resistor; Manufacturer Part Number: RC0805FR-071K05L; Resistance: 1.05 kΩ; Power Rating: 125 mW; Voltage Rating (DC): 150 V; Lead-Free Status: Lead Free; Case/Package (SI): 2012; Octopart URL: http://octopart.com/rc0805fr-071k05l-yageo-44950780; Size-Length: 2.00 mm; Size-Width: 1.25 mm; Resistance Tolerance: ±1%; OctopartID: b5997e3e74036a5e; Mounting Style: Surface Mount; Size-Height: 500 µm; RoHS: Compliant; Case/Package: 0805
R20 = CMP-1854678-3: RC Series 0805 0.125 W 3.24 kOhms 1% ±100 ppm/°C SMT Thick Film Chip Resistor; Manufacturer Part Number: RC0805FR-073K24L; Case/Package (SI): 2012; Resistance: 3240.0 Ω; Voltage Rating (DC): 150.0 V; Power Rating: 0.125 W; Lead-Free Status: Lead Free; Mounting Style: Surface Mount; OctopartID: 6cf6a5ef67a1b331; Size-Length: 0.002 m; Case/Package: 0805; Size-Width: 0.00125 m; Size-Height: 0.0005 m; RoHS: Compliant; Resistance Tolerance: ±1%; Octopart Url: https://octopart.com/rc0805fr-073k24l-yageo-1257009
R21 = CMP-1875655-3: RC Series 0805 0.125 W 442 kOhms 1% ±100 ppm/°C SMT Thick Film Chip Resistor; Manufacturer Part Number: RC0805FR-07442KL; Power Rating: 0.125 W; Case/Package (SI): 2012; Resistance: 442000.0 Ω; Lead-Free Status: Lead Free; Voltage Rating (DC): 150.0 V; RoHS: Compliant; Size-Length: 0.002 m; OctopartID: 47c68edfe6f69801; Size-Width: 0.00125 m; Case/Package: 0805; Resistance Tolerance: ±1%; Size-Height: 0.0005 m; Mounting Style: Surface Mount; Octopart Url: https://octopart.com/rc0805fr-07442kl-yageo-1279062
R22 = CMP-97215c7414f848e6-2: RC Series 0805 0.125 W 196 kOhms 1% ±100 ppm/°C SMT Thick Film Chip Resistor; Manufacturer Part Number: RC0805FR-07196KL; Voltage Rating (DC): 150 V; Resistance: 196 kΩ; Lead-Free Status: Lead Free; Power Rating: 125 mW; Case/Package (SI): 2012; Case/Package: 0805; Size-Length: 2.00 mm; Size-Height: 500 µm; Mounting Style: Surface Mount; RoHS: Compliant; Octopart URL: http://octopart.com/rc0805fr-07196kl-yageo-39823039; Size-Width: 1.25 mm; OctopartID: 97215c7414f848e6; Resistance Tolerance: ±1%
R23 = CMP-1854639-3: RC Series 0805 0.125 W 24.3 kOhms 1% ±100 ppm/°C SMT Thick Film Chip Resistor; Manufacturer Part Number: RC0805FR-0724K3L; Voltage Rating (DC): 150.0 V; Lead-Free Status: Lead Free; Resistance: 24300.0 Ω; Power Rating: 0.125 W; Case/Package (SI): 2012; Resistance Tolerance: ±1%; OctopartID: 20e4e9ffe712ff23; Mounting Style: Surface Mount; Size-Length: 0.002 m; RoHS: Compliant; Size-Height: 0.0005 m; Case/Package: 0805; Octopart Url: https://octopart.com/rc0805fr-0724k3l-yageo-1172112; Size-Width: 0.00125 m
R24 = CMP-1854533-3: RC Series 0805 0.125 W 102 kOhms 1% ±100 ppm/°C SMT Thick Film Chip Resistor; Manufacturer Part Number: RC0805FR-07102KL; Voltage Rating (DC): 150.0 V; Lead-Free Status: Lead Free; Case/Package (SI): 2012; Resistance: 102000.0 Ω; Power Rating: 0.125 W; Size-Length: 0.002 m; Size-Height: 0.0005 m; RoHS: Compliant; Mounting Style: Surface Mount; Resistance Tolerance: ±1%; Octopart Url: https://octopart.com/rc0805fr-07102kl-yageo-16265867; Case/Package: 0805; Size-Width: 0.00125 m; OctopartID: adc76435ba2a7200
R25 = CMP-a88663d3e8667741-1: RC Series 0805 0.125 W 40.2 kOhms 1% ±100 ppm/°C SMT Thick Film Chip Resistor; Manufacturer Part Number: RC0805FR-0740K2L; Case/Package (SI): 2012; Lead-Free Status: Lead Free; Resistance: 40.2 kΩ; Power Rating: 125 mW; Voltage Rating (DC): 150 V; Case/Package: 0805; OctopartID: a88663d3e8667741; Resistance Tolerance: ±1%; Octopart URL: http://octopart.com/rc0805fr-0740k2l-yageo-39806342; Size-Length: 2.00 mm; Mounting Style: Surface Mount; Size-Width: 1.25 mm; Size-Height: 500 µm; RoHS: Compliant
R26 = CMP-c8620311b81c17a5-2: RC Series 0805 0.125 W 18.7 kOhms 1% ±100 ppm/°C SMT Thick Film Chip Resistor; Manufacturer Part Number: RC0805FR-0718K7L; Resistance: 18.7 kΩ; Power Rating: 125 mW; Case/Package (SI): 2012; Lead-Free Status: Lead Free; Voltage Rating (DC): 150 V; RoHS: Compliant; Size-Height: 500 µm; Size-Length: 2.00 mm; Mounting Style: Surface Mount; OctopartID: c8620311b81c17a5; Octopart URL: http://octopart.com/rc0805fr-0718k7l-yageo-41506072; Resistance Tolerance: ±1%; Case/Package: 0805; Size-Width: 1.25 mm
R27 = CMP-7c68b5716a47a3af-1: RC Series 0805 0.125 W 3.01 kOhms 1% ±100 ppm/°C SMT Thick Film Chip Resistor; Manufacturer Part Number: RC0805FR-073K01L; Voltage Rating (DC): 150 V; Lead-Free Status: Lead Free; Resistance: 3.01 kΩ; Power Rating: 125 mW; Case/Package (SI): 2012; Size-Width: 1.25 mm; Case/Package: 0805; Resistance Tolerance: ±1%; Size-Length: 2.00 mm; Size-Height: 500 µm; Packaging: Cut Tape (CT); RoHS: Compliant; OctopartID: 7c68b5716a47a3af; Octopart URL: http://octopart.com/rc0805fr-073k01l-yageo-1258313; Mounting Style: Surface Mount
R28 = CMP-f925303c7afe26e2-2: RC Series 0805 0.125 W 8.06 kOhms 1% ±100 ppm/°C SMT Thick Film Chip Resistor; Manufacturer Part Number: RC0805FR-078K06L; Lead-Free Status: Lead Free; Case/Package (SI): 2012; Voltage Rating (DC): 150 V; Resistance: 8.06 kΩ; Power Rating: 125 mW; Case/Package: 0805; Size-Width: 1.25 mm; Octopart URL: http://octopart.com/rc0805fr-078k06l-yageo-1287869; Size-Height: 500 µm; OctopartID: f925303c7afe26e2; Mounting Style: Surface Mount; RoHS: Compliant; Resistance Tolerance: ±1%; Size-Length: 2.00 mm
R29 = CMP-bfd776c8b5e36010-1: RC Series 0805 0.125 W 60.4 kOhms 1% ±100 ppm/°C SMT Thick Film Chip Resistor; Manufacturer Part Number: RC0805FR-0760K4L; Voltage Rating (DC): 150 V; Power Rating: 125 mW; Case/Package (SI): 2012; Lead-Free Status: Lead Free; Resistance: 60.4 kΩ; OctopartID: bfd776c8b5e36010; Size-Width: 1.25 mm; Mounting Style: Surface Mount; Size-Height: 500 µm; RoHS: Compliant; Octopart URL: http://octopart.com/rc0805fr-0760k4l-yageo-1388370; Size-Length: 2.00 mm; Resistance Tolerance: ±1%; Case/Package: 0805
R30 = CMP-1875654-3: RC Series 0805 0.125 W 21 kOhms 1% ±100 ppm/°C SMT Thick Film Chip Resistor; Manufacturer Part Number: RC0805FR-0721KL; Power Rating: 0.125 W; Resistance: 21000.0 Ω; Lead-Free Status: Lead Free; Case/Package (SI): 2012; Voltage Rating (DC): 150.0 V; Size-Width: 0.00125 m; Octopart Url: https://octopart.com/rc0805fr-0721kl-yageo-1211048; Mounting Style: Surface Mount; Case/Package: 0805; Size-Length: 0.002 m; Size-Height: 0.0005 m; OctopartID: 2708ee1078c6f8cf; RoHS: Compliant; Resistance Tolerance: ±1%
R31 = CMP-5dec96b9cda1822b-1: RC Series 0805 0.125 W 215 kOhms 1% ±100 ppm/°C SMT Thick Film Chip Resistor; Manufacturer Part Number: RC0805FR-07215KL; Lead-Free Status: Lead Free; Power Rating: 125 mW; Case/Package (SI): 2012; Voltage Rating (DC): 150 V; Resistance: 215 kΩ; Size-Height: 500 µm; Size-Width: 1.25 mm; Resistance Tolerance: ±1%; Mounting Style: Surface Mount; Octopart URL: http://octopart.com/rc0805fr-07215kl-yageo-39826731; RoHS: Compliant; Case/Package: 0805; Size-Length: 2.00 mm; OctopartID: 5dec96b9cda1822b
R32 = CMP-1855242-3: RC Series 0805 0.125 W 4.02 Ohms 1% ±100 ppm/°C SMT Thick Film Chip Resistor; Manufacturer Part Number: RC0805FR-074R02L; Resistance: 4.02 Ω; Voltage Rating (DC): 150.0 V; Lead-Free Status: Lead Free; Power Rating: 0.125 W; Case/Package (SI): 2012; RoHS: Compliant; Octopart Url: https://octopart.com/rc0805fr-074r02l-yageo-1224385; Resistance Tolerance: ±1%; Size-Length: 0.002 m; Mounting Style: Surface Mount; Case/Package: 0805; OctopartID: 7930b028f297a6f7; Size-Width: 0.00125 m; Size-Height: 0.0005 m
R33 = CMP-8094498c85275f53-2: RC Series 0805 0.125 W 11.5k Ohm 1% ±100 ppm/°C SMT Thick Film Chip Resistor; Manufacturer Part Number: RC0805FR-0711K5L; Voltage Rating (DC): 150 V; Power Rating: 125 mW; Lead-Free Status: Lead Free; Resistance: 11.5 kΩ; Case/Package (SI): 2012; Resistance Tolerance: ±1%; Size-Width: 1.25 mm; OctopartID: 8094498c85275f53; Size-Length: 2.00 mm; Mounting Style: Surface Mount; Case/Package: 0805; Size-Height: 500 µm; Octopart URL: http://octopart.com/rc0805fr-0711k5l-yageo-1188053; RoHS: Compliant
R34 R35 = CMP-1875921-6: Res Thick Film 0805 0 Ohm Molded SMD Paper T/R; Resistance Tolerance: ±1%; Resistance: 0.0 ?; Lead-Free Status: Lead Free; Case/Package: 0805; OctopartID: f3d13a5618eb2c16; RoHS: Compliant; Octopart Url: https://octopart.com/rc0805fr-070rl-yageo-9293404; Mounting Style: Surface Mount
R36 = CMP-1854489-3: RC Series 0805 0.125 W 1.37 kOhms 1% ±100 ppm/°C SMT Thick Film Chip Resistor; Manufacturer Part Number: RC0805FR-071K37L; Resistance: 1370.0 Ω; Case/Package (SI): 2012; Voltage Rating (DC): 150.0 V; Lead-Free Status: Lead Free; Power Rating: 0.125 W; Size-Length: 0.002 m; Octopart Url: https://octopart.com/rc0805fr-071k37l-yageo-1396419; Size-Width: 0.00125 m; RoHS: Compliant; Size-Height: 0.0005 m; Mounting Style: Surface Mount; Case/Package: 0805; OctopartID: 9800511ff3a547c7; Resistance Tolerance: ±1%
R37 = CMP-5d85960ed7bd8242-1: RC Series 0805 0.125 W 3.32 kOhms 1% ±100 ppm/°C SMT Thick Film Chip Resistor; Manufacturer Part Number: RC0805FR-073K32L; Lead-Free Status: Lead Free; Resistance: 3.32 kΩ; Voltage Rating (DC): 150 V; Power Rating: 125 mW; Case/Package (SI): 2012; Resistance Tolerance: ±1%; Size-Width: 1.25 mm; RoHS: Compliant; OctopartID: 5d85960ed7bd8242; Size-Length: 2.00 mm; Case/Package: 0805; Size-Height: 500 µm; Mounting Style: Surface Mount; Octopart URL: http://octopart.com/rc0805fr-073k32l-yageo-42053470
R38 R39 = CMP-1875921-8: Res Thick Film 0805 0 Ohm Molded SMD Paper T/R; Manufacturer Part Number: RC0805FR-070RL; Resistance Tolerance: ±1%; Resistance: 0.0 Ω; Lead-Free Status: Lead Free; OctopartID: f3d13a5618eb2c16; Case/Package: 0805; Mounting Style: Surface Mount; Octopart Url: https://octopart.com/rc0805fr-070rl-yageo-9293404; RoHS: Compliant
R41 R42 = CMP-1854428-5: RC Series 0805 0.125 W 549 Ohms 1% ±100 ppm/°C SMT Thick Film Chip Resistor; Manufacturer Part Number: RC0805FR-07549RL; Resistance: 549.0 Ω; Case/Package (SI): 2012; Power Rating: 0.125 W; Voltage Rating (DC): 150.0 V; Lead-Free Status: Lead Free; Resistance Tolerance: ±1%; Size-Length: 0.002 m; OctopartID: 9ff456ec81fc4033; Octopart Url: https://octopart.com/rc0805fr-07549rl-yageo-1194862; Mounting Style: Surface Mount; Size-Height: 0.0005 m; Size-Width: 0.00125 m; Case/Package: 0805; RoHS: Compliant
U1 = CMP-20381226-2: High Voltage, High Current Buck-Boost Battery Charge Controller with Maximum Power Point Tracking (MPPT), 6 to 80V, -40 to 125 degC, 58-Pin QFN(UKJ64); Input Voltage (DC): 80.0 V; Number of Pins: 64; Octopart Url: https://octopart.com/lt8490eukj%23pbf-linear+technology-46678137; OctopartID: 5899935b3d86875e; Packaging: Cut Tape (CT); REACH SVHC Compliance: No SVHC; RoHS: Compliant; Manufacturer Part Number: LT8490EUKJ#PBF